# Altium schematic sheet MCU.SchDoc
size Legal; SheetNumber: 2; SheetTotal: 5
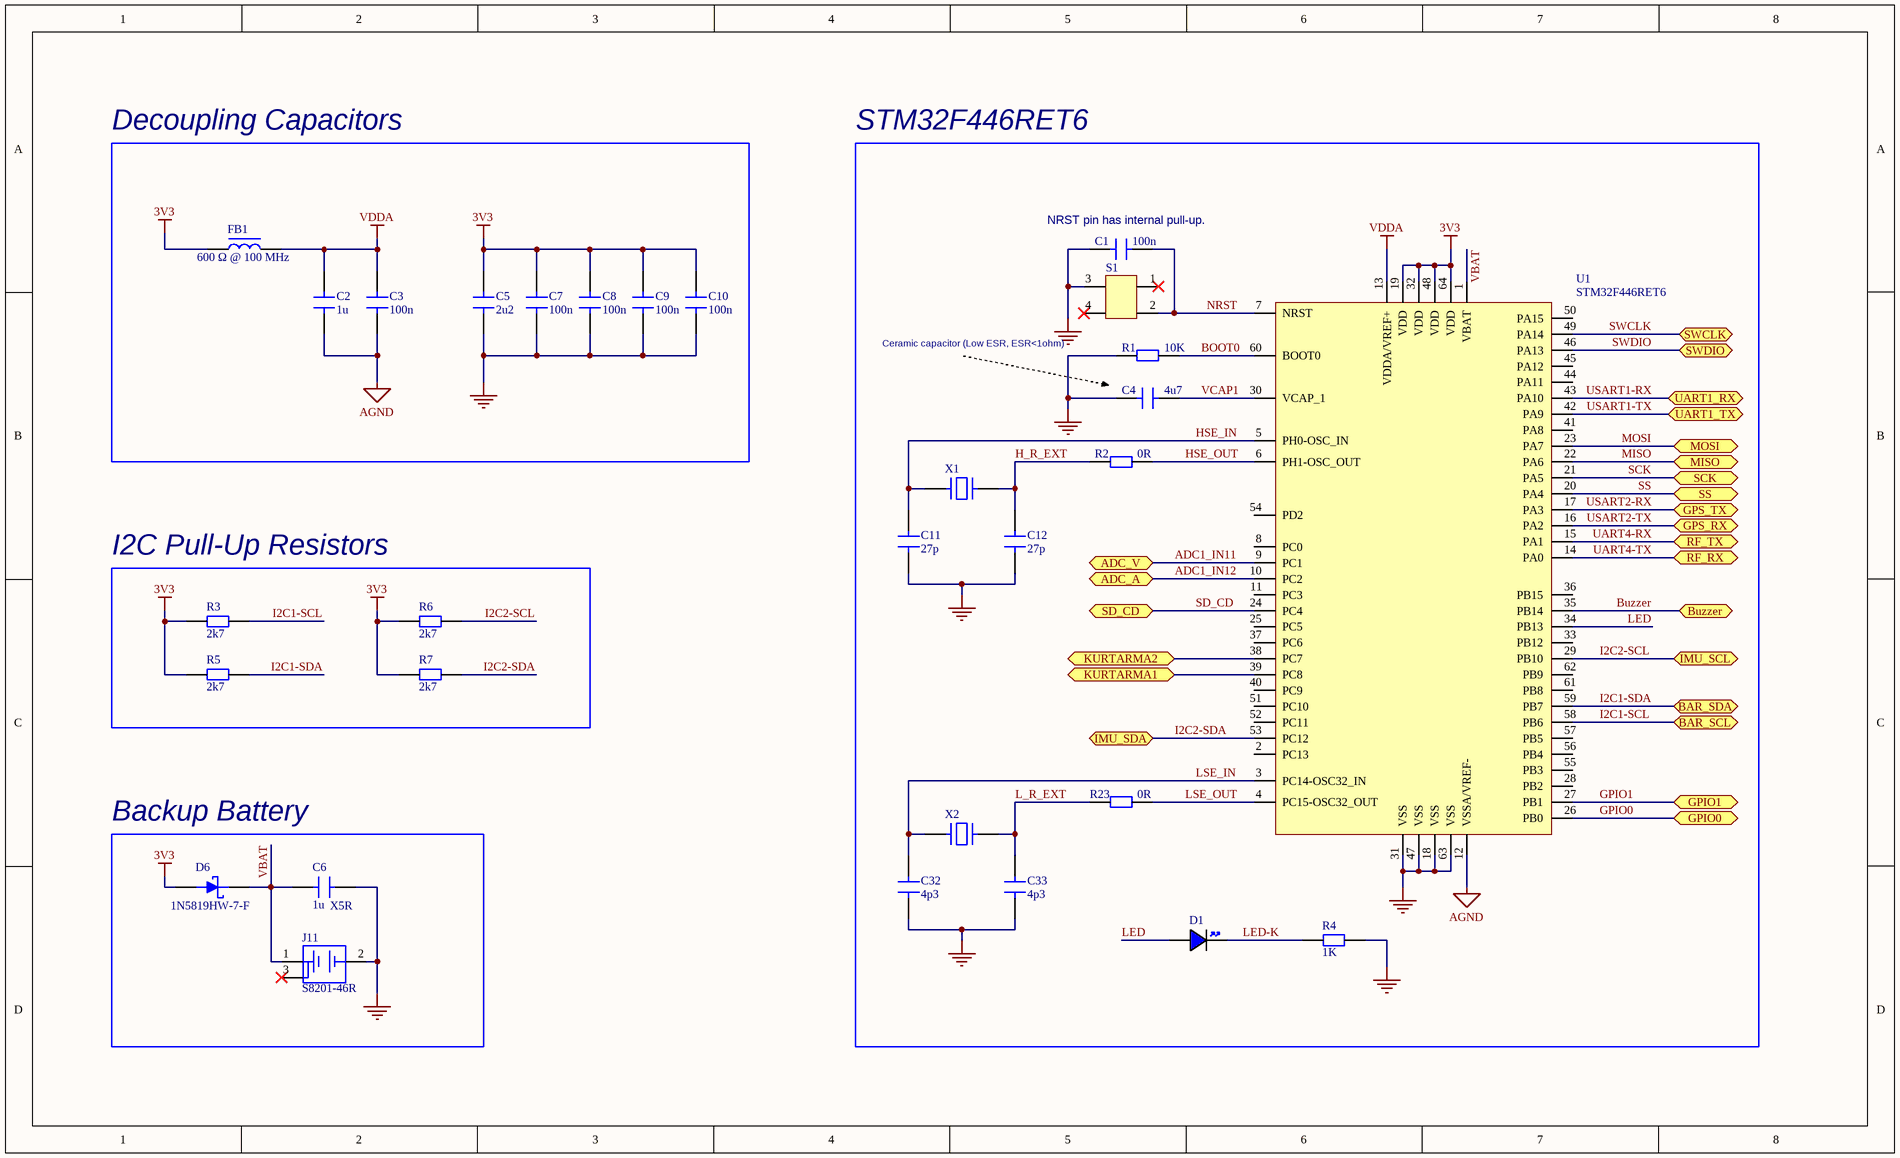
[diagram p0: MCU.SchDoc]

## Parts
C1  100n  [CAP 0603]
C2  1u  [CAP 0805]
C3  100n  [CAP 0603]
C4  4u7  [CAP 0805]
C5  2u2  [CAP 0805]
C6  1u  [CAP 0603]
C7  100n  [CAP 0603]
C8  100n  [CAP 0603]
C9  100n  [CAP 0603]
C10  100n  [CAP 0603]
C11  27p  [CAP 0603]
C12  27p  [CAP 0603]
C32  4p3  [CAP 0603]
C33  4p3  [CAP 0603]
D1  LED 0805 BLUE  [LED 0805 BLUE]  (value not drawn)
D6  1N5819HW-7-F  [1N5819HW-7-F]
FB1  600 Ω @ 100 MHz  [FB 0805]
J11  S8201-46R  [S8201-46R]
R1  10K  [RES 0603]
R2  0R  [RES 0603]
R3  2k7  [RES 0603]
R4  1K  [RES 0603]
R5  2k7  [RES 0603]
R6  2k7  [RES 0603]
R7  2k7  [RES 0603]
R23  0R  [RES 0603]
S1  FSM4JSMATR  [FSM4JSMATR]  (value not drawn)
U1  STM32F446RET6  [STM32F446RET6]
X1  ABM3-8.000MHZ-D2Y-T  [ABM3-8.000MHZ-D2Y-T]  (value not drawn)
X2  ABS25-32.768KHZ-6-T  [ABS25-32.768KHZ-6-T]  (value not drawn)

## Blocks framed on the sheet
Decoupling Capacitors: C2 C3 C5 C7-C10 FB1
STM32F446RET6: C1 C4 C11 C12 C32 C33 D1 R1 R2 R4 R23 S1 U1 X1 X2
I2C Pull-Up Resistors: R3 R5-R7
Backup Battery: C6 D6 J11

## Ports
ADC_A (bidir, see Power[3C]), ADC_V (bidir, see Power[1C]), BAR_SCL (bidir, see Connectors[3C], Peripherals[1A]), BAR_SDA (bidir, see Connectors[3C], Peripherals[1A]), Buzzer (bidir, see Peripherals[6B]), GPIO0 (bidir, see Connectors[4A]), GPIO1 (bidir, see Connectors[4B]), GPS_RX (bidir, see Peripherals[5C]), GPS_TX (bidir, see Peripherals[5C]), IMU_SCL (bidir, see Connectors[4C], Peripherals[4A]), IMU_SDA (bidir, see Connectors[4C], Peripherals[4A]), KURTARMA1 (bidir, see Peripherals[3D]), KURTARMA2 (bidir, see Peripherals[5D]), MISO (bidir, see Connectors[3A]), MOSI (bidir, see Connectors[3A]), RF_RX (bidir, see Peripherals[2C]), RF_TX (bidir, see Peripherals[2C]), SCK (bidir, see Connectors[3A]), SD_CD (bidir, see Connectors[3B]), SS (bidir, see Connectors[3B]), SWCLK (bidir, see Connectors[2C]), SWDIO (bidir, see Connectors[2D]), UART1_RX (bidir, see Connectors[2A]), UART1_TX (bidir, see Connectors[2A])

## Nets
3V3: C5.2 C7.2 C8.2 C9.2 C10.2 D6.C FB1.1 R3.2 R5.2 R6.2 R7.2 U1.19(VDD) U1.32(VDD) U1.48(VDD) U1.64(VDD)
AGND: C2.1 C3.1 U1.12(VSSA/VREF-)
GND: C1.1 C4.1 C5.1 C6.1 C7.1 C8.1 C9.1 C10.1 C11.1 C12.1 C32.1 C33.1 J11.2(-) R1.1 R4.2 S1.3 U1.18(VSS) U1.31(VSS) U1.47(VSS) U1.63(VSS)
VDDA: C2.2 C3.2 FB1.2 U1.13(VDDA/VREF+)
ADC1_IN11: U1.9(PC1) ; port ADC_V
ADC1_IN12: U1.10(PC2) ; port ADC_A
BOOT0: R1.2 U1.60(BOOT0)
Buzzer: U1.35(PB14) ; port Buzzer
GPIO0: U1.26(PB0) ; port GPIO0
GPIO1: U1.27(PB1) ; port GPIO1
H_R_EXT: C12.2 R2.1 X1.2
HSE_IN: C11.2 U1.5(PH0-OSC_IN) X1.1
HSE_OUT: R2.2 U1.6(PH1-OSC_OUT)
I2C1-SCL: R3.1 U1.58(PB6) ; port BAR_SCL
I2C1-SDA: R5.1 U1.59(PB7) ; port BAR_SDA
I2C2-SCL: R6.1 U1.29(PB10) ; port IMU_SCL
I2C2-SDA: R7.1 U1.53(PC12) ; port IMU_SDA
KURTARMA1: U1.39(PC8) ; port KURTARMA1
KURTARMA2: U1.38(PC7) ; port KURTARMA2
L_R_EXT: C33.2 R23.1 X2.4
LED: D1.A U1.34(PB13)
LED-K: D1.K R4.1
LSE_IN: C32.2 U1.3(PC14-OSC32_IN) X2.1
LSE_OUT: R23.2 U1.4(PC15-OSC32_OUT)
MISO: U1.22(PA6) ; port MISO
MOSI: U1.23(PA7) ; port MOSI
NRST: C1.2 S1.2 U1.7(NRST)
SCK: U1.21(PA5) ; port SCK
SD_CD: U1.24(PC4) ; port SD_CD
SS: U1.20(PA4) ; port SS
SWCLK: U1.49(PA14) ; port SWCLK
SWDIO: U1.46(PA13) ; port SWDIO
UART4-RX: U1.15(PA1) ; port RF_TX
UART4-TX: U1.14(PA0) ; port RF_RX
USART1-RX: U1.43(PA10) ; port UART1_RX
USART1-TX: U1.42(PA9) ; port UART1_TX
USART2-RX: U1.17(PA3) ; port GPS_TX
USART2-TX: U1.16(PA2) ; port GPS_RX
VBAT: C6.2 D6.A J11.1(+) U1.1(VBAT)
VCAP1: C4.2 U1.30(VCAP_1)

Not connected (* = marked no-connect by the designer): J11 3(+)*; S1 1* 4*; U1 2(PC13) 8(PC0) 11(PC3) 25(PC5) 28(PB2) 33(PB12) 36(PB15) 37(PC6) 40(PC9) 41(PA8) 44(PA11) 45(PA12) 50(PA15) 51(PC10) 52(PC11) 54(PD2) 55(PB3) 56(PB4) 57(PB5) 61(PB8) 62(PB9)

## Notes on the sheet
- (near C1) NRST pin has internal pull-up.
- Ceramic capacitor (Low ESR, ESR<1ohm)
- (near C6) X5R

## Library data of the parts
C1 C3 C7-C12 C32 C33 = CAP 0603 50V: Capacitor SMD 0603 50V
C2 = CAP 0805 50V: Capacitor SMD 0805 50V
C4 C5 = CAP 0805 25V: Capacitor SMD 0805 25V
C6 = CAP 0603 16V: Capacitor SMD 0603 16V
D1 = LED 0805 BLUE: LED 0805 BLUE SMD
D6 = 1N5819HW-7-F: Rectifier Diode, Schottky, 1 Phase, 1 Element, 1A, 40V V(RRM), Silicon; Manufacturer: Diodes; Max Reverse Current: 50uA; Peak Non-Repetitive Surge Current: 25A; Forward Voltage: 450mV; Max Power Dissipation: 450mW; Polarity: Standard; Capacitance: 50pF; Supplier 1: Future Electronics; Manufacturer Part Number: 1N5819HW-7-F; RoHS: Yes; Category: Rectifier Diodes; Stock 1: 5079000; Pricing 1: 3000=0,0409, 9000=0,0394, 15000=0,0388, 60000=0,037, 90000=0,0358 (USD); Case/Package: SOD-123-2; Number of Pins: 2; Weight: 0.000353oz; Min Operating Temperature: -65°C; Max Operating Temperature: 125°C; Forward Current: 1A; Max Repetitive Reverse Voltage (Vrrm): 40V; Package Quantity: 3000; Packaging: Tape and Reel; Average Rectified Current: 1A; Max Forward Surge Current (Ifsm): 25A; Termination: SMD/SMT; Voltage Rating (DC): 40V; Current Rating: 1A; Output Current: 1A; Max Reverse Voltage (DC): 40V; Series: -; Reverse Voltage: 40V; Length: 2.85mm; Width: 1.7mm; Height: 1.25mm; Radiation Hardening: No; Reach SVHC Compliant: No; Lead Free: Lead Free; RoHS Compliant: Yes; ComponentLink1URL: https://datasheet.ciiva.com/27092/1538419-27092484.pdf?src-supplier=Jameco; ComponentLink1Description: https://datasheet.ciiva.com/27092/1538419-27092484.pdf?src-supplier=Jameco; ComponentLink2URL: https://datasheet.ciiva.com/16303/ds30217-16303296.pdf?src-supplier=Future+Electronics; ComponentLink2Description: https://datasheet.ciiva.com/16303/ds30217-16303296.pdf?src-supplier=Future+Electronics; ComponentLink3URL: https://datasheet.ciiva.com/1177/ds30217-1177089.pdf?src-supplier=Element14; ComponentLink3Description: https://datasheet.ciiva.com/1177/ds30217-1177089.pdf?src-supplier=Element14; ComponentLink4URL: https://datasheet.ciiva.com/8303/ds30217-8303132.pdf?src-supplier=Avnet; ComponentLink4Description: https://datasheet.ciiva.com/8303/ds30217-8303132.pdf?src-supplier=Avnet; ComponentLink5URL: https://datasheet.ciiva.com/912/ds30217-912802.pdf?src-supplier=Digikey; ComponentLink5Description: https://datasheet.ciiva.com/912/ds30217-912802.pdf?src-supplier=Digikey; ComponentLink6URL: https://datasheet.ciiva.com/912/ds30217-912803.pdf?src-supplier=Digikey; ComponentLink6Description: https://datasheet.ciiva.com/912/ds30217-912803.pdf?src-supplier=Digikey; ComponentLink7URL: https://datasheet.ciiva.com/912/ds30217-912801.pdf?src-supplier=Digikey; ComponentLink7Description: https://datasheet.ciiva.com/912/ds30217-912801.pdf?src-supplier=Digikey
FB1 = FB 0805: Ferrite Bead SMD 0805
J11 = S8201-46R: Battery Holder, Coin Cell, 1225, Smd Rohs Compliant: Yes |Harwin S8201-46R; Manufacturer: Harwin; Number of Contacts: 2NUMBER; Supplier 1: Farnell; Manufacturer Part Number: S8201-46R; RoHS: Yes; Category: Connectors; Stock 1: 4494; Pricing 1: 1=0,926, 25=0,765, 75=0,589, 200=0,555, 500=0,48 (EUR); Contact Material: 153,154ConductorMaterial; Height: 3.25mm; ComponentLink1URL: https://datasheet.ciiva.com/4/s8201r-4048.pdf?src-supplier=Digikey; ComponentLink1Description: https://datasheet.ciiva.com/4/s8201r-4048.pdf?src-supplier=Digikey; ComponentLink2URL: https://datasheet.ciiva.com/4642/c0430120-20coin20cell20battery20retainers-55143-4642583.pdf?src-supplier=Mouser; ComponentLink2Description: https://datasheet.ciiva.com/4642/c0430120-20coin20cell20battery20retainers-55143-4642583.pdf?src-supplier=Mouser; ComponentLink3URL: https://datasheet.ciiva.com/1391/1458706-1391064.pdf?src-supplier=Element14; ComponentLink3Description: https://datasheet.ciiva.com/1391/1458706-1391064.pdf?src-supplier=Element14; ComponentLink4URL: https://datasheet.ciiva.com/4/s8201r-4049.pdf?src-supplier=Digikey; ComponentLink4Description: https://datasheet.ciiva.com/4/s8201r-4049.pdf?src-supplier=Digikey
R1-R7 R23 = RES 0603: Resistor SMD 0603
S1 = FSM4JSMATR: Switch Tactile OFF (ON) SPST Round Button Gull Wing 0.05A 24VDC 1.57N SMD T/R; Manufacturer: TE Connectivity Alcoswitch; Supplier 1: Digi-Key; Manufacturer Part Number: FSM4JSMATR; RoHS: Yes; Category: Pushbutton Switches; Stock 1: 84996; Pricing 1: 1=0,36, 10=0,351, 25=0,33, 100=0,2866, 250=0,26, 500=0,24188 (USD); ComponentLink1URL: https://datasheet.ciiva.com/16320/eng-cs-1308111-1-switches-core-program-catalog-0308-16320065.pdf?src-supplier=Future+Electronics; ComponentLink1Description: https://datasheet.ciiva.com/16320/eng-cs-1308111-1-switches-core-program-catalog-0308-16320065.pdf?src-supplier=Future+Electronics; ComponentLink2URL: https://datasheet.ciiva.com/1530/1683375-1530944.pdf?src-supplier=Element14; ComponentLink2Description: https://datasheet.ciiva.com/1530/1683375-1530944.pdf?src-supplier=Element14; ComponentLink3URL: https://datasheet.ciiva.com/23765/1486934-23765878.pdf?src-supplier=Newark; ComponentLink3Description: https://datasheet.ciiva.com/23765/1486934-23765878.pdf?src-supplier=Newark; ComponentLink4URL: https://datasheet.ciiva.com/7638/921681-7638037.pdf?src-supplier=Element14; ComponentLink4Description: https://datasheet.ciiva.com/7638/921681-7638037.pdf?src-supplier=Element14
U1 = STM32F446RET6: ARM® Cortex®-M4 STM32 F4 Microcontroller IC 32-Bit 180MHz 512KB (512K x 8) FLASH 64-LQFP (10x10); Manufacturer: STMicroelectronics; Supplier 1: Mouser; Manufacturer Part Number: STM32F446RET6; RoHS: Yes; Category: Microcontrollers; Stock 1: 2954; Pricing 1: 1=12,45, 10=11,25, 50=10,54, 100=9,5, 1000=6,72, 10000=6,72 (USD); ComponentLink1URL: http://www.mouser.com/ds/2/389/stm32f446mc-956216.pdf?src-supplier=Mouser; ComponentLink1Description: http://www.mouser.com/ds/2/389/stm32f446mc-956216.pdf?src-supplier=Mouser; ComponentLink2URL: http://www.farnell.com/datasheets/2309063.pdf?src-supplier=Farnell; ComponentLink2Description: http://www.farnell.com/datasheets/2309063.pdf?src-supplier=Farnell; ComponentLink3URL: https://datasheet.octopart.com/STM32F446RET6-STMicroelectronics-datasheet-58295083.pdf?src-supplier=Future+Electronics; ComponentLink3Description: https://datasheet.octopart.com/STM32F446RET6-STMicroelectronics-datasheet-58295083.pdf?src-supplier=Future+Electronics; ComponentLink4URL: http://www.st.com/content/ccc/resource/technical/document/datasheet/65/cb/75/50/53/d6/48/24/DM00141306.pdf/files/DM00141306.pdf/jcr:content/translations/en.DM00141306.pdf?src-supplier=Digi-Key; ComponentLink4Description: http://www.st.com/content/ccc/resource/technical/document/datasheet/65/cb/75/50/53/d6/48/24/DM00141306.pdf/files/DM00141306.pdf/jcr:content/translations/en.DM00141306.pdf?src-supplier=Digi-Key; ComponentLink5URL: http://www.farnell.com/datasheets/2309063.pdf?src-supplier=Element14; ComponentLink5Description: http://www.farnell.com/datasheets/2309063.pdf?src-supplier=Element14; ComponentLink6URL: https://datasheet.octopart.com/STM32F446RET6-STMicroelectronics-datasheet-41797127.pdf?src-supplier=Element14; ComponentLink6Description: https://datasheet.octopart.com/STM32F446RET6-STMicroelectronics-datasheet-41797127.pdf?src-supplier=Element14; ComponentLink7URL: http://www.farnell.com/datasheets/2309063.pdf?src-supplier=Newark; ComponentLink7Description: http://www.farnell.com/datasheets/2309063.pdf?src-supplier=Newark; ComponentLink8URL: https://datasheet.octopart.com/STM32F446RET6-STMicroelectronics-datasheet-83961502.pdf?src-supplier=SHENGYU+ELECTRONICS; ComponentLink8Description: https://datasheet.octopart.com/STM32F446RET6-STMicroelectronics-datasheet-83961502.pdf?src-supplier=SHENGYU+ELECTRONICS
X1 = ABM3-8.000MHZ-D2Y-T: Crystal 8MHz ±20ppm (Tol) ±30ppm (Stability) 18pF FUND 140Ohm 2-Pin Mini-CSMD T/R; Manufacturer: Abracon; Supplier 1: Future Electronics; Manufacturer Part Number: ABM3-8.000MHZ-D2Y-T; RoHS: Yes; Category: Crystals; Stock 1: 237000; Pricing 1: 1000=0,325, 2000=0,275, 3000=0,315, 4000=0,27, 5000=0,31, 10000=0,305, 20000=0,295 (USD); Reach SVHC Compliant: 4187SVHC; ComponentLink1URL: https://datasheet.ciiva.com/862/abm3-862465.pdf?src-supplier=Digikey; ComponentLink1Description: https://datasheet.ciiva.com/862/abm3-862465.pdf?src-supplier=Digikey
X2 = ABS25-32.768KHZ-6-T: Crystal, Plastic Molded 32.768Khz, 6Pf, 20Ppm-40+85C, 8 X 3.8 X 2.5 Rohs Compliant: Yes; Manufacturer: Abracon; Supplier 1: Future Electronics; Manufacturer Part Number: ABS25-32.768KHZ-6-T; RoHS: Yes; Category: Crystals; Stock 1: 399000; Pricing 1: 3000=0,375, 6000=0,365, 9000=0,365, 12000=0,36, 15000=0,35 (USD); ComponentLink1URL: https://datasheet.ciiva.com/854/abs25-854528.pdf?src-supplier=Digi-Key; ComponentLink1Description: https://datasheet.ciiva.com/854/abs25-854528.pdf?src-supplier=Digi-Key; ComponentLink2URL: https://datasheet.ciiva.com/26909/getdatasheetpartid-722397-26909970.pdf?src-supplier=Verical; ComponentLink2Description: https://datasheet.ciiva.com/26909/getdatasheetpartid-722397-26909970.pdf?src-supplier=Verical; ComponentLink3URL: https://datasheet.ciiva.com/854/abs25-854527.pdf?src-supplier=Digi-Key; ComponentLink3Description: https://datasheet.ciiva.com/854/abs25-854527.pdf?src-supplier=Digi-Key; ComponentLink4URL: https://datasheet.ciiva.com/854/abs25-854529.pdf?src-supplier=Digi-Key; ComponentLink4Description: https://datasheet.ciiva.com/854/abs25-854529.pdf?src-supplier=Digi-Key; ComponentLink5URL: https://datasheet.ciiva.com/5788/abs25-5788102.pdf?src-supplier=Farnell; ComponentLink5Description: https://datasheet.ciiva.com/5788/abs25-5788102.pdf?src-supplier=Farnell; ComponentLink6URL: https://datasheet.ciiva.com/1357/1856019-1357324.pdf?src-supplier=Element14; ComponentLink6Description: https://datasheet.ciiva.com/1357/1856019-1357324.pdf?src-supplier=Element14; ComponentLink7URL: https://datasheet.ciiva.com/7998/1856019-7998662.pdf?src-supplier=Element14; ComponentLink7Description: https://datasheet.ciiva.com/7998/1856019-7998662.pdf?src-supplier=Element14